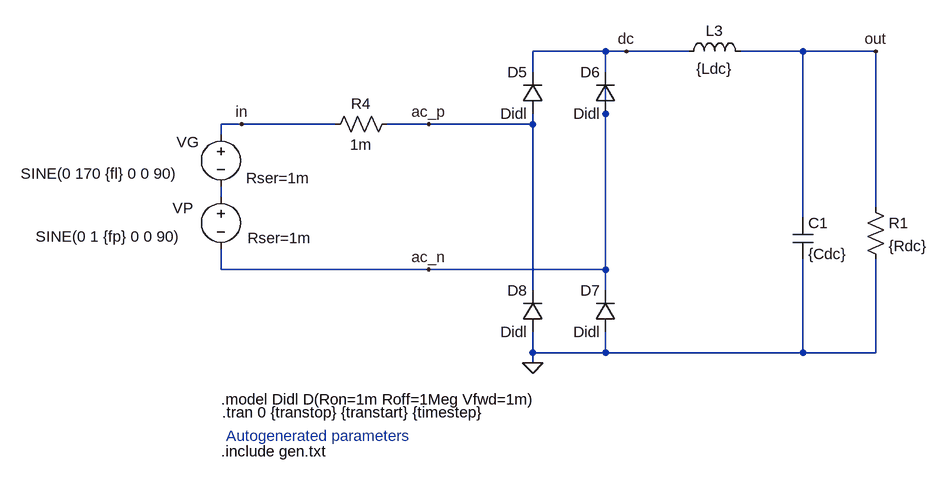
[diagram p0: schematic base.asc]
base.asc, the LTspice schematic file:
Version 4
SHEET 1 2640 776
WIRE 512 -480 400 -480
WIRE 544 -480 512 -480
WIRE 640 -480 544 -480
WIRE 816 -480 720 -480
WIRE 928 -480 816 -480
WIRE 400 -448 400 -480
WIRE 512 -448 512 -480
WIRE 512 -384 512 -432
WIRE -48 -368 -80 -368
WIRE 96 -368 -48 -368
WIRE 240 -368 176 -368
WIRE 400 -368 400 -384
WIRE 400 -368 240 -368
WIRE -80 -352 -80 -368
WIRE -80 -256 -80 -272
WIRE 928 -240 928 -480
WIRE 816 -224 816 -480
WIRE -80 -144 -80 -176
WIRE 240 -144 -80 -144
WIRE 512 -144 512 -384
WIRE 512 -144 240 -144
WIRE 400 -112 400 -368
WIRE 512 -112 512 -144
WIRE 400 -16 400 -48
WIRE 512 -16 512 -48
WIRE 512 -16 400 -16
WIRE 816 -16 816 -160
WIRE 816 -16 512 -16
WIRE 928 -16 928 -160
WIRE 928 -16 816 -16
WIRE 400 0 400 -16
FLAG 400 0 0
FLAG 544 -480 dc
FLAG 240 -368 ac_p
FLAG 240 -144 ac_n
FLAG 928 -480 out
FLAG -48 -368 in
SYMBOL res 80 -352 R270
WINDOW 0 32 56 VTop 2
WINDOW 3 0 56 VBottom 2
SYMATTR InstName R4
SYMATTR Value 1m
SYMBOL diode 416 -384 R180
WINDOW 0 24 64 Left 2
WINDOW 3 24 0 Left 2
SYMATTR InstName D5
SYMATTR Value Didl
SYMBOL diode 528 -384 R180
WINDOW 0 24 64 Left 2
WINDOW 3 24 0 Left 2
SYMATTR InstName D6
SYMATTR Value Didl
SYMBOL diode 528 -48 R180
WINDOW 0 24 64 Left 2
WINDOW 3 24 0 Left 2
SYMATTR InstName D7
SYMATTR Value Didl
SYMBOL diode 416 -48 R180
WINDOW 0 24 64 Left 2
WINDOW 3 24 0 Left 2
SYMATTR InstName D8
SYMATTR Value Didl
SYMBOL voltage -80 -368 R0
WINDOW 123 0 0 Left 2
WINDOW 39 39 83 Left 2
WINDOW 3 -308 76 Left 2
WINDOW 0 -68 28 Left 2
SYMATTR SpiceLine Rser=1m
SYMATTR Value SINE(0 170 {fl} 0 0 90)
SYMATTR InstName VG
SYMBOL voltage -80 -272 R0
WINDOW 0 -74 33 Left 2
WINDOW 39 41 79 Left 2
WINDOW 3 -285 77 Left 2
WINDOW 123 0 0 Left 0
SYMATTR InstName VP
SYMATTR SpiceLine Rser=1m
SYMATTR Value SINE(0 1 {fp} 0 0 90)
SYMBOL ind 624 -464 R270
WINDOW 0 32 56 VTop 2
WINDOW 3 5 56 VBottom 2
SYMATTR InstName L3
SYMATTR Value {Ldc}
SYMATTR SpiceLine Rser=1m
SYMBOL cap 800 -224 R0
SYMATTR InstName C1
SYMATTR Value {Cdc}
SYMATTR SpiceLine Rser=1m
SYMBOL res 912 -256 R0
SYMATTR InstName R1
SYMATTR Value {Rdc}
TEXT -80 56 Left 2 !.model Didl D(Ron=1m Roff=1Meg Vfwd=1m)
TEXT -80 136 Left 2 !.include gen.txt
TEXT -72 112 Left 2 ;Autogenerated parameters
TEXT -78 76 Left 2 !.tran 0 {transtop} {transtart} {timestep}

The netlist it stands for:
* base.asc
R4 in ac_p 1m
D5 ac_p dc Didl
D6 ac_n dc Didl
D7 0 ac_n Didl
D8 0 ac_p Didl
VG in N001 SINE(0 170 {fl} 0 0 90) Rser=1m
VP N001 ac_n SINE(0 1 {fp} 0 0 90) Rser=1m
L3 dc out {Ldc} Rser=1m
C1 out 0 {Cdc} Rser=1m
R1 out 0 {Rdc}
.model D D
.lib standard.dio
.model Didl D(Ron=1m Roff=1Meg Vfwd=1m)
.include gen.txt
* Autogenerated parameters
.tran 0 {transtop} {transtart} {timestep}
.backanno
.end